# Altium schematic sheet signal_transfer_Sch.SchDoc
size 297 x 209 mm; SheetNumber: 1; SheetTotal: 1
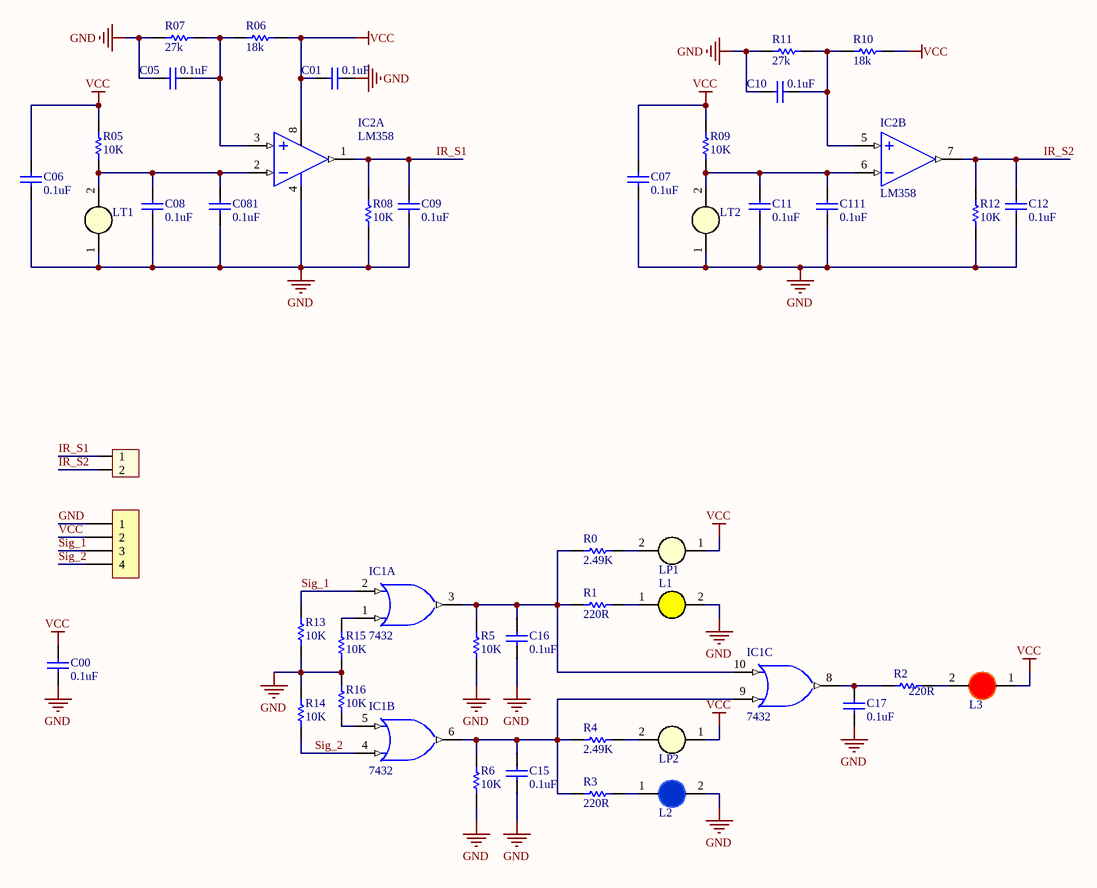
[diagram p0: signal_transfer_Sch.SchDoc]

## Parts
C00  value 0.1uF  [CAP-SM-0603]  (hidden comment: Cap Non-Pol SMD)
C01  value 0.1uF  [CAP-SM-0603]  (hidden comment: Cap Non-Pol SMD)
C05  value 0.1uF  [CAP-SM-0603]  (hidden comment: Cap Non-Pol SMD)
C06  value 0.1uF  [CAP-SM-0603]  (hidden comment: Cap Non-Pol SMD)
C07  value 0.1uF  [CAP-SM-0603]  (hidden comment: Cap Non-Pol SMD)
C08  value 0.1uF  [CAP-SM-0603]  (hidden comment: Cap Non-Pol SMD)
C09  value 0.1uF  [CAP-SM-0603]  (hidden comment: Cap Non-Pol SMD)
C10  value 0.1uF  [CAP-SM-0603]  (hidden comment: Cap Non-Pol SMD)
C11  value 0.1uF  [CAP-SM-0603]  (hidden comment: Cap Non-Pol SMD)
C12  value 0.1uF  [CAP-SM-0603]  (hidden comment: Cap Non-Pol SMD)
C15  value 0.1uF  [CAP-SM-0603]  (hidden comment: Cap Non-Pol SMD)
C16  value 0.1uF  [CAP-SM-0603]  (hidden comment: Cap Non-Pol SMD)
C17  value 0.1uF  [CAP-SM-0603]  (hidden comment: Cap Non-Pol SMD)
C081  value 0.1uF  [CAP-SM-0603]  (hidden comment: Cap Non-Pol SMD)
C111  value 0.1uF  [CAP-SM-0603]  (hidden comment: Cap Non-Pol SMD)
H00  Header 4P 2.54 Duc Thang  [XH2.54M-4]  (value not drawn)
H01  Header 2P 2.54 Duc Thang  [XH2.54M-2]  (value not drawn)
IC1  7432  [SO14]  (parts A,B,C of 4)
IC2  LM358  [SO8]  (parts A,B of 2)
L1  LED 5mm  [LED-5MM-Yellow]  (value not drawn)
L2  LED 5mm  [LED-5MM-BLUE]  (value not drawn)
L3  LED 5mm  [LED-5MM-RED]  (value not drawn)
LP1  LED 5mm  [LED-5MM-WHITE]  (value not drawn)
LP2  LED 5mm  [LED-5MM-WHITE]  (value not drawn)
LT1  LED 5mm  [LED-5MM-WHITE]  (value not drawn)
LT2  LED 5mm  [LED-5MM-WHITE]  (value not drawn)
R0  value 2.49K  [RES-SM-0603]  (hidden comment: RESISTOR SMD)
R1  value 220R  [RES-SM-0603]  (hidden comment: RESISTOR SMD)
R2  value 220R  [RES-SM-0603]  (hidden comment: RESISTOR SMD)
R3  value 220R  [RES-SM-0603]  (hidden comment: RESISTOR SMD)
R4  value 2.49K  [RES-SM-0603]  (hidden comment: RESISTOR SMD)
R05  value 10K  [RES-SM-0603]  (hidden comment: RESISTOR SMD)
R5  value 10K  [RES-SM-0603]  (hidden comment: RESISTOR SMD)
R06  value 18k  [RES-SM-0603]  (hidden comment: RESISTOR SMD)
R6  value 10K  [RES-SM-0603]  (hidden comment: RESISTOR SMD)
R07  value 27k  [RES-SM-0603]  (hidden comment: RESISTOR SMD)
R08  value 10K  [RES-SM-0603]  (hidden comment: RESISTOR SMD)
R09  value 10K  [RES-SM-0603]  (hidden comment: RESISTOR SMD)
R10  value 18k  [RES-SM-0603]  (hidden comment: RESISTOR SMD)
R11  value 27k  [RES-SM-0603]  (hidden comment: RESISTOR SMD)
R12  value 10K  [RES-SM-0603]  (hidden comment: RESISTOR SMD)
R13  value 10K  [RES-SM-0603]  (hidden comment: RESISTOR SMD)
R14  value 10K  [RES-SM-0603]  (hidden comment: RESISTOR SMD)
R15  value 10K  [RES-SM-0603]  (hidden comment: RESISTOR SMD)
R16  value 10K  [RES-SM-0603]  (hidden comment: RESISTOR SMD)

## Nets
GND: C00.2 C01.2 C05.1 C06.2 C07.2 C08.2 C09.2 C10.2 C11.2 C12.2 C15.2 C16.2 C17.2 C081.2 C111.2 H00.1 IC1.7(GND) IC2.4(-V) L1.2(K) L2.2(K) LT1.1(A) LT2.1(A) R5.2 R6.2 R07.1 R08.1 R11.1 R12.1 R13.1 R14.2 R15.1 R16.2
VCC: C00.1 C01.1 C06.1 C07.1 H00.2 IC1.14(VCC) IC2.8(+V) L3.1(A) LP1.1(A) LP2.1(A) R05.2 R06.2 R09.2 R10.2
IR_S1: C09.1 H01.1 IC2.1(OUT) R08.2
IR_S2: C12.1 H01.2 IC2.7(OUT) R12.2
Sig_1: H00.3 IC1.2(B) R13.2
Sig_2: H00.4 IC1.4(A) R14.1
NetC05_2: C05.2 IC2.3(IN+) R06.1 R07.2
NetC08_1: C08.1 C081.1 IC2.2(IN-) LT1.2(K) R05.1
NetC10_1: C10.1 IC2.5(IN+) R10.1 R11.2
NetC11_1: C11.1 C111.1 IC2.6(IN-) LT2.2(K) R09.1
NetC15_1: C15.1 IC1.6(Y) IC1.9(A) R3.1 R4.1 R6.1
NetC16_1: C16.1 IC1.3(Y) IC1.10(B) R0.1 R1.1 R5.1
NetC17_1: C17.1 IC1.8(Y) R2.1
NetIC1_1: IC1.1(A) R15.2
NetIC1_5: IC1.5(B) R16.1
NetL1_1: L1.1(A) R1.2
NetL2_1: L2.1(A) R3.2
NetL3_2: L3.2(K) R2.2
NetLP1_2: LP1.2(K) R0.2
NetLP2_2: LP2.2(K) R4.2

## Notes on the sheet
- NGUYEN VAN SON

## Library data of the parts
C00 C01 C05 C06 C07 C08 C09-C12 C15-C17 C081 C111 = Cap Non-Pol SMD: Capacitor
H00 = Header 4P 2.54 Duc Thang: Cắm; Ten_Linh_Kien: Header 4P XH2.54-4P Đực Thẳng; Don_Vi: Con; Ma_Hang: MH001285; Chung_Loai: Cắm
H01 = Header 2P 2.54 Duc Thang: Cắm; Ten_Linh_Kien: Header 2P XH2.54-2P Đực Thẳng; Don_Vi: Con; Ma_Hang: MH001283; Chung_Loai: Cắm
IC1 = 7432: Quad 2-Input OR Gate
IC2 = LM358: Low-Power Dual Operational Amplifier; Value: LM358
L1 = LED 5mm Vang: Cắm; Don_Vi: Con; Ma_Hang: MH008968; Ten_Linh_Kien: Led 5MM Phủ Vàng (1000c); Ghi_Chu: *; Kieu_Chan: *; Chung_Loai: Cắm
L2 = LED 5mm Xanh Duong: Cắm; Don_Vi: Con; Ma_Hang: MH008987; Ten_Linh_Kien: Led 5MM Xanh Dương Đục (1000c); Ghi_Chu: *; Kieu_Chan: *; Chung_Loai: Cắm
L3 = LED 5mm Do: Cắm; Don_Vi: Con; Ma_Hang: MH008967; Ten_Linh_Kien: Led 5MM Phủ Đỏ (1000c); Ghi_Chu: *; Kieu_Chan: *; Chung_Loai: Cắm
LP1 LP2 LT1 LT2 = LED 5mm Trang: Cắm; Don_Vi: Con; Ma_Hang: MH008983; Ten_Linh_Kien: Led 5MM Trắng Đục (1000c); Ghi_Chu: *; Kieu_Chan: *; Chung_Loai: Cắm
R0-R4 R05 R5 R06 R6 R07 R08 R09-R16 = RESISTOR SMD: Resistor